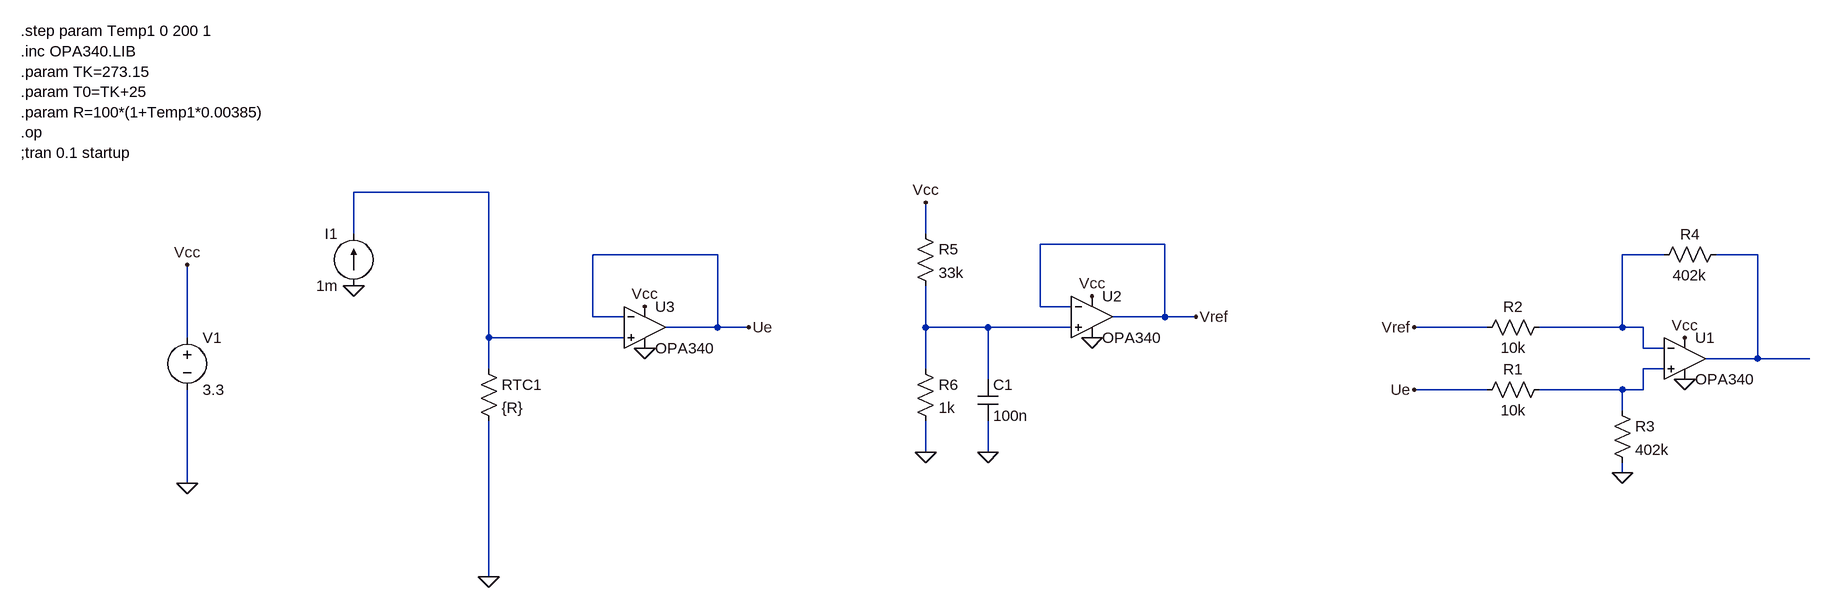
[diagram p0: schematic PT1000_Circuit_v04.asc]
PT1000_Circuit_v04.asc, the LTspice schematic file:
Version 4
SHEET 1 1588 680
WIRE -448 -176 -656 -176
WIRE -656 -112 -656 -176
WIRE 224 -112 224 -160
WIRE 592 -96 400 -96
WIRE -96 -80 -288 -80
WIRE 1360 -80 1296 -80
WIRE 1504 -80 1440 -80
WIRE 400 0 400 -96
WIRE 448 0 400 0
WIRE -288 16 -288 -80
WIRE -240 16 -288 16
WIRE 592 16 592 -96
WIRE 592 16 512 16
WIRE 640 16 592 16
WIRE -96 32 -96 -80
WIRE -96 32 -176 32
WIRE -48 32 -96 32
WIRE 224 32 224 -32
WIRE 320 32 224 32
WIRE 448 32 320 32
WIRE 1088 32 976 32
WIRE 1296 32 1296 -80
WIRE 1296 32 1168 32
WIRE 1328 32 1296 32
WIRE -912 48 -912 -64
WIRE -448 48 -448 -176
WIRE -240 48 -448 48
WIRE 1328 64 1328 32
WIRE 1360 64 1328 64
WIRE 1504 80 1504 -80
WIRE 1504 80 1424 80
WIRE 1584 80 1504 80
WIRE -448 96 -448 48
WIRE 224 96 224 32
WIRE 1360 96 1328 96
WIRE 320 112 320 32
WIRE 1088 128 976 128
WIRE 1296 128 1168 128
WIRE 1328 128 1328 96
WIRE 1328 128 1296 128
WIRE 1296 160 1296 128
WIRE 224 224 224 176
WIRE 320 224 320 176
WIRE 1296 256 1296 240
WIRE -912 272 -912 128
WIRE -448 416 -448 176
FLAG -912 272 0
FLAG -912 -64 Vcc
FLAG -448 416 0
FLAG -656 -32 0
FLAG 1392 48 Vcc
FLAG 1392 112 0
FLAG 976 128 Ue
FLAG 976 32 Vref
FLAG 1296 256 0
FLAG 480 -16 Vcc
FLAG 480 48 0
FLAG 640 16 Vref
FLAG 224 224 0
FLAG 320 224 0
FLAG 224 -160 Vcc
FLAG -208 0 Vcc
FLAG -208 64 0
FLAG -48 32 Ue
SYMBOL voltage -912 32 R0
WINDOW 123 0 0 Left 2
WINDOW 39 0 0 Left 2
SYMATTR InstName V1
SYMATTR Value 3.3
SYMBOL res -464 80 R0
SYMATTR InstName RTC1
SYMATTR Value {R}
SYMBOL current -656 -32 R180
WINDOW 0 24 80 Left 2
WINDOW 3 24 0 Left 2
WINDOW 123 0 0 Left 2
WINDOW 39 0 0 Left 2
SYMATTR InstName I1
SYMATTR Value 1m
SYMBOL Opamps\\opamp2 1392 16 R0
SYMATTR InstName U1
SYMATTR Value OPA340
SYMATTR SpiceModel OPA340
SYMBOL res 1184 112 R90
WINDOW 0 0 56 VBottom 2
WINDOW 3 32 56 VTop 2
SYMATTR InstName R1
SYMATTR Value 10k
SYMBOL res 1184 16 R90
WINDOW 0 0 56 VBottom 2
WINDOW 3 32 56 VTop 2
SYMATTR InstName R2
SYMATTR Value 10k
SYMBOL res 1280 144 R0
SYMATTR InstName R3
SYMATTR Value 402k
SYMBOL res 1344 -64 R270
WINDOW 0 32 56 VTop 2
WINDOW 3 0 56 VBottom 2
SYMATTR InstName R4
SYMATTR Value 402k
SYMBOL Opamps\\opamp2 480 -48 R0
SYMATTR InstName U2
SYMATTR Value OPA340
SYMATTR SpiceModel OPA340
SYMBOL res 208 -128 R0
SYMATTR InstName R5
SYMATTR Value 33k
SYMBOL res 208 80 R0
SYMATTR InstName R6
SYMATTR Value 1k
SYMBOL cap 304 112 R0
SYMATTR InstName C1
SYMATTR Value 100n
SYMBOL Opamps\\opamp2 -208 -32 R0
SYMATTR InstName U3
SYMATTR Value OPA340
SYMATTR SpiceModel OPA340
TEXT -1168 -424 Left 2 !.step param Temp1 0 200 1\n.inc OPA340.LIB\n.param TK=273.15\n.param T0=TK+25\n.param R=100*(1+Temp1*0.00385)\n.op\n;tran 0.1 startup

The netlist it stands for:
* PT1000_Circuit_v04.asc
V1 Vcc 0 3.3
RTC1 N001 0 {R}
I1 0 N001 1m
XU1 N005 N002 Vcc 0 N003 OPA340 OPA340  ; pins In+ In- V+ V- OUT
R1 N005 Ue 10k
R2 N002 Vref 10k
R3 N005 0 402k
R4 N002 N003 402k
XU2 N004 Vref Vcc 0 Vref OPA340 OPA340  ; pins In+ In- V+ V- OUT
R5 Vcc N004 33k
R6 N004 0 1k
C1 N004 0 100n
XU3 N001 Ue Vcc 0 Ue OPA340 OPA340  ; pins In+ In- V+ V- OUT
.step param Temp1 0 200 1
.inc OPA340.LIB
.param TK=273.15
.param T0=TK+25
.param R=100*(1+Temp1*0.00385)
.op
;tran 0.1 startup
.backanno
.end